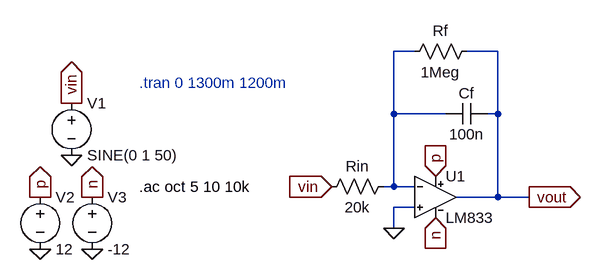
[diagram p0: schematic phase-shift-opamp.asc]
phase-shift-opamp.asc, the LTspice schematic file:
Version 4
SHEET 1 880 680
WIRE 320 208 288 208
WIRE 448 208 400 208
WIRE 288 304 288 208
WIRE 368 304 288 304
WIRE 448 304 448 208
WIRE 448 304 432 304
WIRE 288 416 288 304
WIRE 288 416 272 416
WIRE 320 416 288 416
WIRE 448 432 448 304
WIRE 448 432 384 432
WIRE 496 432 448 432
WIRE 320 448 288 448
WIRE 288 480 288 448
FLAG -208 368 0
FLAG -208 288 vin
IOPIN -208 288 Out
FLAG 192 416 vin
IOPIN 192 416 In
FLAG 288 480 0
FLAG 496 432 vout
IOPIN 496 432 Out
FLAG -256 512 0
FLAG -176 512 0
FLAG -256 432 p
IOPIN -256 432 Out
FLAG -176 432 n
IOPIN -176 432 Out
FLAG 352 400 p
IOPIN 352 400 In
FLAG 352 464 n
IOPIN 352 464 In
SYMBOL Voltage -208 272 R0
SYMATTR InstName V1
SYMATTR Value SINE(0 1 50)
SYMATTR Value2 AC 1
SYMBOL Res 288 400 R90
WINDOW 0 0 56 VBottom 2
WINDOW 3 32 56 VTop 2
SYMATTR InstName Rin
SYMATTR Value 20k
SYMBOL Cap 432 288 R90
WINDOW 0 0 32 VBottom 2
WINDOW 3 32 32 VTop 2
SYMATTR InstName Cf
SYMATTR Value 100n
SYMBOL LM833 352 368 R0
SYMATTR InstName U1
SYMBOL Voltage -256 416 R0
SYMATTR InstName V2
SYMATTR Value 12
SYMBOL Voltage -176 416 R0
SYMATTR InstName V3
SYMATTR Value -12
SYMBOL Res 416 192 R90
WINDOW 0 0 56 VBottom 2
WINDOW 3 32 56 VTop 2
SYMATTR InstName Rf
SYMATTR Value 1Meg
TEXT -104 256 Left 2 ;.tran 0 1300m 1200m
TEXT -104 416 Left 2 !.ac oct 5 10 10k

The netlist it stands for:
* phase-shift-opamp.asc
V1 vin 0 SINE(0 1 50) AC 1
Rin N001 vin 20k
Cf vout N001 100n
XU1 0 N001 p n vout LM833  ; pins In+ In- V+ V- OUT
V2 p 0 12
V3 n 0 -12
Rf vout N001 1Meg
* .tran 0 1300m 1200m
.ac oct 5 10 10k
.lib LM833.sub
.backanno
.end